# EAGLE design msrgyro (EAGLE 9.6.2)
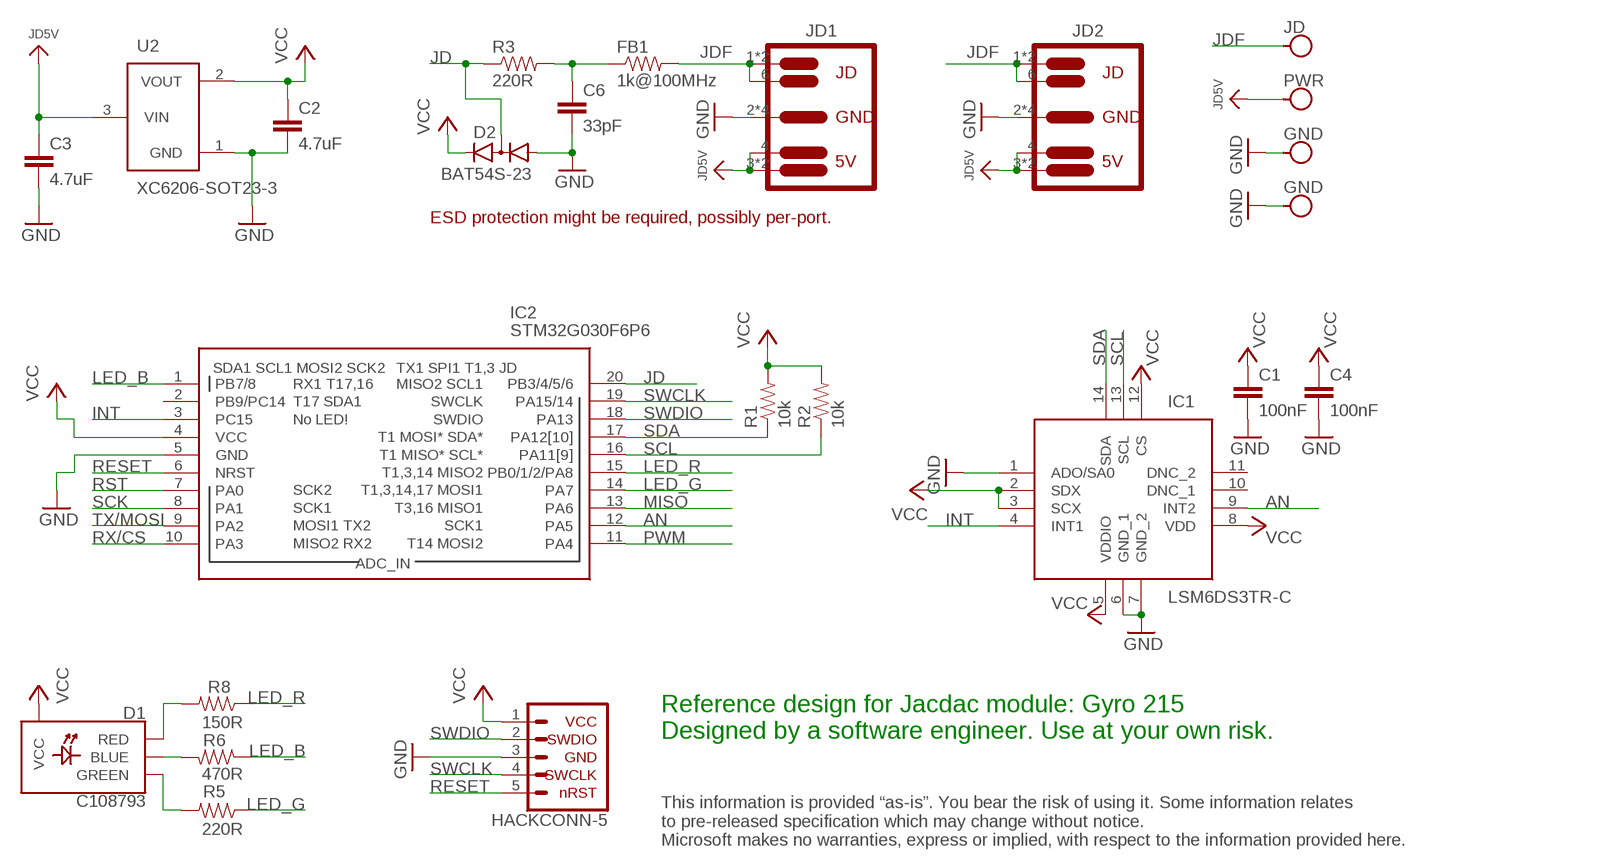
[diagram p0: schematic, sheet 1]

## Parts
C1  100nF  CAP_0402  [0402]
C2  4.7uF  CAP_0402  [0402]
C3  4.7uF  CAP_0402  [0402]
C4  100nF  CAP_0402  [0402]
C6  33pF  CAP_0402  [0402]
D1  C108793  LED-RGB-CA-2020  [LED-RGB-2020]
D2  BAT54S-23  [SOT23-3]
FB1  1k@100MHz  RES_0402  [0402]
IC1  LSM6DS3TR-C  [LGA-14-2.5_3]
IC2  STM32G030F6P6  STM32G030F8P6  [SOP65P640X120-20N]
J1  JD  JACDAC-M3-DATA  [M3-HOLE-DATA]
J2  PWR  JACDAC-M3-PWR  [M3-HOLE-PWR]
J3  GND  JACDAC-M3-GND  [M3-HOLE-GND]
J4  GND  JACDAC-M3-GND  [M3-HOLE-GND]
J6  HACK-CONNECT-5  [HC5-22-62]
JD1  JACDAC-EDGE-OUTIE  [JD-EDGE-OUTIE]
JD2  JACDAC-EDGE-OUTIE  [JD-EDGE-OUTIE]
R1  10k  RES_0402  [0402]
R2  10k  RES_0402  [0402]
R3  220R  RES_0402  [0402]
R5  220R  RES_0402  [0402]
R6  470R  RES_0402  [0402]
R8  150R  RES_0402  [0402]
U2  XC6206-SOT23-3  [SOT23-3-W]

## Nets
AN: IC1.9(INT2) IC2.12(PA5)
GND [gnd]: C1.2 C2.2 C3.2 C4.2 C6.2 D2.1(A1) IC1.1(ADO/SA0) IC1.6(GND_1) IC1.7(GND_2) IC2.5(GND) J3.H J4.H J6.3(GND) JD1.2 JD1.5 JD1.P$2 JD1.P$4 JD2.2 JD2.5 JD2.P$2 JD2.P$4 U2.1(GND)
INT: IC1.4(INT1) IC2.3(PC15)
JD: D2.3(C1A2) IC2.20(PB3/4/5/6) R3.1
JD5V [usbvcc]: C3.1 J2.H JD1.3 JD1.4 JD1.P$1 JD2.3 JD2.4 JD2.P$1 U2.3(VIN)
JDF: FB1.2 J1.H JD1.1 JD1.6 JD1.P$3 JD2.1 JD2.6 JD2.P$3
LED_B: IC2.1(PB7/8) R6.1
LED_G: IC2.14(PA7) R5.1
LED_R: IC2.15(PB0/1/2/PA8) R8.1
MISO: IC2.13(PA6)
N$1: C6.1 FB1.1 R3.2
N$2: D1.B-(BLUE) R6.2
N$3: D1.R-(RED) R8.2
N$4: D1.G-(GREEN) R5.2
PWM: IC2.11(PA4)
RESET: IC2.6(NRST) J6.5(NRST)
RST: IC2.7(PA0)
RX/CS: IC2.10(PA3)
SCK: IC2.8(PA1)
SCL: IC1.13(SCL) IC2.16(PA11[9]) R2.1
SDA: IC1.14(SDA) IC2.17(PA12[10]) R1.1
SWCLK: IC2.19(PA15/14) J6.4(SWCLK)
SWDIO: IC2.18(PA13) J6.2(SWDIO)
TX/MOSI: IC2.9(PA2)
VCC: C1.1 C2.1 C4.1 D1.PLUS(VCC) D2.2(C2) IC1.2(SDX) IC1.3(SCX) IC1.5(VDDIO) IC1.8(VDD) IC1.12(CS) IC2.4(VCC) J6.1(VCC) R1.2 R2.2 U2.2(VOUT)
Unconnected: IC1.10(DNC_1) IC1.11(DNC_2) IC2.2(PB9/PC14)

## Notes on the sheet
- ESD protection might be required, possibly per-port.
- Reference design for Jacdac module: Gyro 215
  Designed by a software engineer. Use at your own risk.
- This information is provided “as-is”. You bear the risk of using it. Some information relates
  to pre-released specification which may change without notice.
  Microsoft makes no warranties, express or implied, with respect to the information provided here.

## Library data of the parts
C1-C4 C6 = jacdac:CAP_0402: 0402 (1005 Metric) Nick Garner - TeleSense
D1 = jacdac:LED-RGB-CA: RGB LED, common anode
D2 = jacdac:BAT54S: B54S two Schottky Diodes JLC408389 ALT: JLC 47546
FB1 R1-R3 R5 R6 R8 = jacdac:RES_0402: 0402 (1005 Metric) Nick Garner - TeleSense
IC1 = jacdac:LSM6DS3TR-C: LSM6DS3TR-C gyroscope and accelerometer JLC967633 Datasheet <http://www.st.com/resource/en/datasheet/lsm6ds3tr-c.pdf>
IC2 = jacdac:STM32G030F8P6: STM32G030F6P6 TSSOP-20 JLC724040
J1-J4 = jacdac:JACDAC-M3: Jacdac mounting Hole M3
J6 = jacdac:HACK-CONNECT-5
JD1 JD2 = jacdac:JACDAC-EDGE
U2 = jacdac:XC6206: JLC5446

## Net classes
0 default: width 0.152 mm
1 power: width 0.152 mm
2 gnd: width 0.152 mm
3 usbvcc: width 0.305 mm

## Board
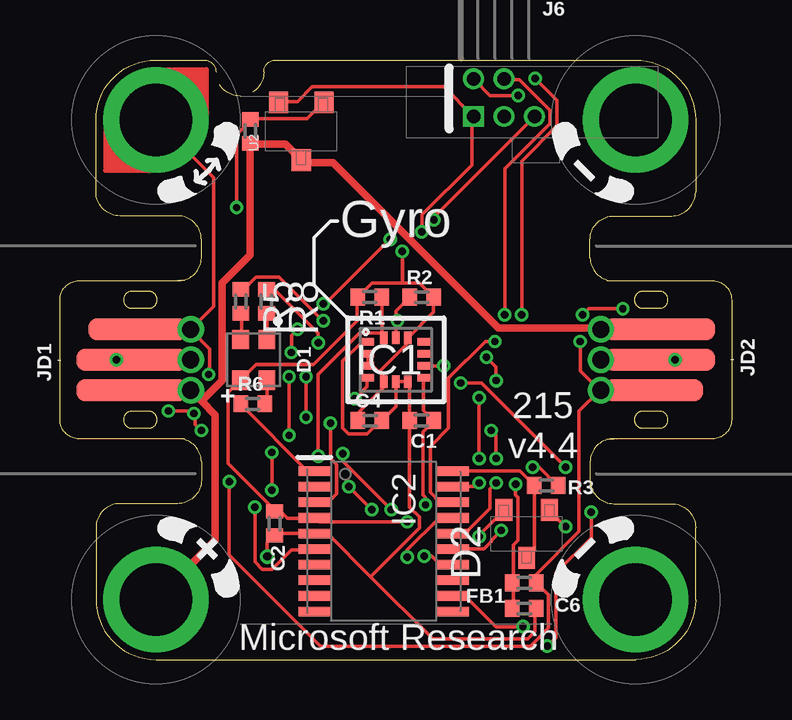
[diagram p1: board, top side]
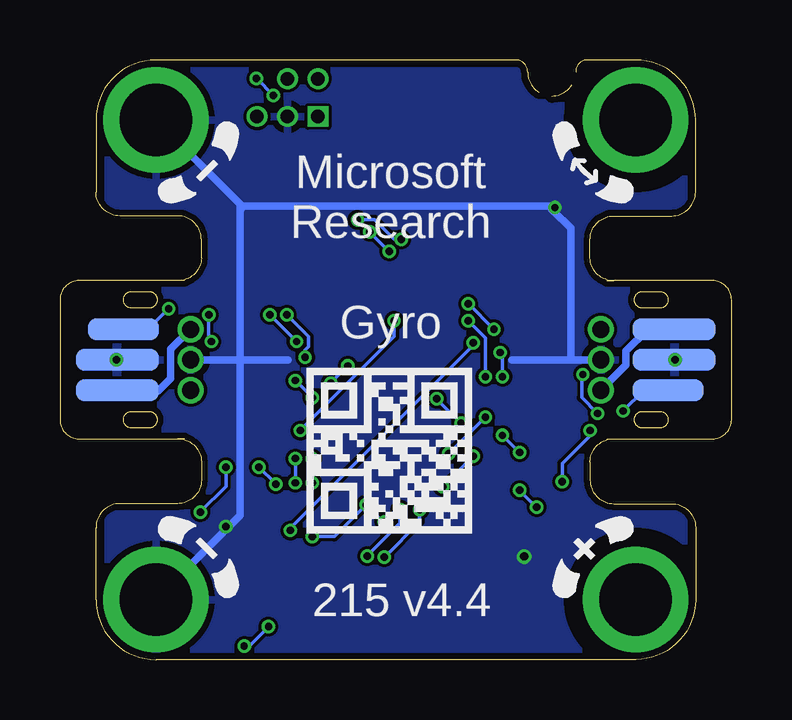
[diagram p2: board, bottom side, seen from below]

Size 28 x 25 mm. Coordinates in mm from the lower left corner, seen from the top.
Outline: 26.5,5.5 26.5,2.5 arc-90 24,0 4,0 arc-90 1.5,2.5 1.5,5.5
Outline: 1.5,19.5 1.5,22.5 arc-90 4,25 6,25 arc-90 6.5,24.5 arc90 7.5,23.5 arc90 8.5,24.5 arc-90 9,25 24,25 arc-90 26.5,22.5 26.5,19.5
Copper layers (1*16): Top 0.035559375mm / dielectric 1.6mm / Bottom 0.035559375mm
Design rules "jlcpcb": minimum track width 5mil, minimum drill 12mil, track to track 5mil, track to pad 5mil, pad to pad 5mil, via to via 5mil, smd to smd 5mil, copper to edge 10mil, drill to drill 8mil, minimum pad ring 5mil, minimum via ring 5mil, stop-mask expansion 2.5mil, vias tented up to drill 30mil, thermal gap 10mil

### Footprints (pad centres in the part's own frame; a part is rotated, then mirrored left to right if it is on the bottom)
0402 = smd 0.6 x 0.7: 1 -0.5,0; 2 0.5,0
LED-RGB-2020 = smd 0.8 x 0.7: B- 0.85,0.55; G- -0.85,-0.55; PLUS 0.85,-0.55; R- -0.85,0.55
SOT23-3 = smd 0.9 x 0.7: 1 1,-0.95; 2 1,0.95; 3 -1,0
LGA-14-2.5_3 = smd 0.52 x 0.32: 1 -1.16,0.75; 2 -1.16,0.25; 3 -1.16,-0.25; 4 -1.16,-0.75; 8 1.16,-0.75; 9 1.16,-0.25; 10 1.16,0.25; 11 1.16,0.75 | smd 0.32 x 0.52: 5 -0.5,-0.912; 6 0,-0.912; 7 0.5,-0.912; 12 0.5,0.912; 13 0,0.912; 14 -0.5,0.912
SOP65P640X120-20N = smd 0.4 x 1.35: 1 -2.925,-2.875; 2 -2.275,-2.875; 3 -1.625,-2.875; 4 -0.975,-2.875; 5 -0.325,-2.875; 6 0.325,-2.875; 7 0.975,-2.875; 8 1.625,-2.875; 9 2.275,-2.875; 10 2.925,-2.875; 11 2.925,2.875; 12 2.275,2.875; 13 1.625,2.875; 14 0.975,2.875; 15 0.325,2.875; 16 -0.325,2.875; 17 -0.975,2.875; 18 -1.625,2.875; 19 -2.275,2.875; 20 -2.925,2.875
M3-HOLE-DATA = drill 3.03 pad 4.4: H 0,0
M3-HOLE-PWR = drill 3.03 pad 4.4: H 0,0
M3-HOLE-GND = drill 3.03 pad 4.4: H 0,0
HC5-22-62 = drill 0.559 pad 0.864 square: 1 0,0 | drill 0.559 pad 0.864: 2 0,1.575; 3 1.27,0; 4 1.27,1.575; 5 2.54,0
JD-EDGE-OUTIE = smd 0.9 x 4.1: 1 1.27,-3.25 | smd 0.9 x 4.6: 2 0,-3; 3 -1.27,-3 | smd 0.9 x 3.45 bottom: 4 1.27,-2.4; 5 0,-2.4 | smd 0.9 x 2.95 bottom: 6 -1.27,-2.65 | drill 0.71 pad 1.1: P$1 -1.27,-5.45; P$2 0,-5.45; P$3 1.27,-5.45 | drill 0.305 pad 0.559: P$4 0,-2.35
SOT23-3-W = smd 0.9 x 0.8: 1 1.2,-0.95; 2 1.2,0.95; 3 -1.2,0

### Placement (x,y rotation side)
C1  15.08,9.97 180 top
C2  8.95,5.68 270 top
C3  7.93,22.03 90 top
C4  12.92,9.97 0 top
C6  19.35,2.13 0 top
D1  8.08,12.5 270 top
D2  19.46,5.24 90 top
FB1  19.35,3.2 0 top
IC1  14,12.5 0 top
IC2  13.49,4.93 270 top
J1  4,22.5 0 top
J2  4,2.5 0 top
J3  24,2.5 0 top
J4  24,22.5 90 top
J6  17.24,22.64 0 top
JD1  0,12.5 90 top
JD2  28,12.5 270 top
R1  12.92,15.11 180 top
R2  15.08,15.11 0 top
R3  20.27,7.26 0 top
R5  7.54,14.94 270 top
R6  8.03,10.66 0 top
R8  8.61,14.94 270 top
U2  10.06,22.02 90 top

### Tracks (layer width: path | path; a pad name or v marks a point on that pad's centre or on a via)
AN  (via drill 0.3)
  Top 0.152: v16,12.24 15.19,12.24 IC1.9 | v16.71,11.53 17.58,11.53 v21.08,8.03 | v22.15,6.15 22.15,5.08 20.68,3.61 20.68,0.91 v20.32,0.56 | v19.3,1.37 18.19,1.37 16.92,2.64 16.41,2.64 IC2.12
  Bottom 0.152: v16.71,11.53 v16,12.24 | v21.08,8.03 21.08,7.21 v22.15,6.15 | v20.32,0.56 20.12,0.56 v19.3,1.37
GND  (via drill 0.3, 0.35)
  Top 0.152: v8.64,4.3 8.64,4.87 C2.2 9.03,5.26 10.56,5.26 10.57,5.23 IC2.5 10.67,5.23 11.18,5.23 12.95,3.45 | JD1.P$2 JD1.2 JD1.P$4 | JD2.P$2 JD2.2 JD2.P$4 | U2.1 10.97,23.22 10.31,22.55 7.98,22.55 C3.2 7.92,22.45 7.37,21.89 v7.37,18.85 | IC1.1 12.8,13.21 12.55,13.21 11.79,12.45 11.79,9.65 12.04,9.4 12.8,9.4 13.36,9.96 C4.2 14,10.54 IC1.6 IC1.7 14.58,11.51 C1.2 14.58,9.91 14.58,6.35 14.99,5.94 14.99,5.49 12.95,3.45 | v21.08,5.54 20.42,6.2 D2.1 | 12.95,3.45 15.54,0.86 19.51,0.86 19.81,1.17 19.81,2.13 C6.2
  Bottom 0.152: v21.08,5.54 21.02,5.48 | v7.37,18.85 7.47,18.75
  Bottom 0.305: JD1.P$2 6.71,12.5 | 6.71,12.5 9.14,12.5 9.16,12.49 | JD2.P$2 18.51,12.5 18.5,12.49 | J3.H 21.02,5.48 20.5,6 20.5,18.75 | J4.H 20.5,19 20.5,18.75 | 6.71,12.5 6.71,17.98 7.47,18.75 7.62,18.9 20.34,18.9 20.5,18.75
  pour Bottom: 2,25 2,0 26,0 26,25
INT  (via drill 0.3)
  Top 0.152: v12.29,10.87 12.8,11.38 12.8,11.73 IC1.4 | v11.28,9.86 11.28,8.38 11.53,8.13 11.53,6.91 11.23,6.6 10.67,6.6 IC2.3
  Bottom 0.152: v11.28,9.86 v12.29,10.87
JD
  Top 0.152: IC2.20 19.18,7.86 R3.1 19.77,4.56 D2.3
JD5V
  Top 0.305: J2.H 6.31,4.81 6.48,4.98 6.48,10.2 5.9,10.78 | 5.9,10.78 JD1.P$1 5.33,11.23 3.05,11.23 JD1.3 | JD2.3 JD2.P$1 22.4,13.82 18.29,13.82 11.38,20.73 10.16,20.73 U2.3 9.4,21.49 7.98,21.49 C3.1 7.92,21.34 7.92,16.87 6.76,15.7 6.76,11.63 5.9,10.78
  Bottom 0.305: JD1.P$1 4.4,12.28 4.4,12.86 3.49,13.77 JD1.4 | JD2.P$1 23.38,12.94 23.38,11.72 23.91,11.19 25.56,11.19 JD2.4
JDF  (via drill 0.3)
  Top 0.152: J1.H 6.4,20.1 6.4,17.42 6.4,14.72 JD1.P$3 5.49,13.72 6.25,12.95 6.25,12.19 6.2,12.14 v6.2,11.89 | v4.52,10.36 5.49,10.36 v5.59,10.26 5.64,10.21 5.64,9.8 v5.89,9.55 | v23.47,14.63 22.05,14.63 v21.79,14.38 | v21.69,13.26 21.69,12.04 22.45,11.28 JD2.P$3 22.5,11.23 21.64,10.36 21.64,5.33 19.86,3.56 19.86,3.2 FB1.2 19.91,3.15 20.37,2.69 20.37,1.32 19.61,0.56 10.87,0.56 7.06,4.37 v7.06,7.42
  Bottom 0.152: v4.52,10.36 3.66,11.23 2.69,11.23 JD1.6 | v5.59,10.26 6.25,10.92 6.25,11.84 v6.2,11.89 | v23.47,14.63 24.28,13.82 25.35,13.82 JD2.6 | v21.79,14.38 21.79,13.36 v21.69,13.26 | v5.89,9.55 5.89,9.35 7.06,8.18 v7.06,7.42
LED_B
  Top 0.152: R6.1 7.57,10.62 10.31,7.87 10.62,7.87 IC2.1
LED_G  (via drill 0.3)
  Top 0.152: v10.97,14.12 9.14,15.95 8.18,15.95 7.67,15.44 7.57,15.44 R5.1 | v10.26,10.11 v10.26,11.79 | v11.79,8.59 11.79,8.28 v13.82,6.25 | v15.19,4.32 15.49,4.32 15.85,3.96 16.36,3.96 IC2.14
  Bottom 0.152: v10.97,14.12 10.26,13.41 v10.26,11.79 | v11.79,8.59 v10.26,10.11 | v13.82,6.25 13.82,5.69 v15.19,4.32
LED_R  (via drill 0.3)
  Top 0.152: v10.77,13.21 10.77,13.61 8.99,15.39 8.64,15.39 R8.1 | v18.39,5.38 17.98,4.98 17.98,4.93 17.68,4.62 16.41,4.62 IC2.15
  Bottom 0.152: v10.77,13.21 10.77,13.11 18.39,5.49 v18.39,5.38
N$1  (via drill 0.3)
  Top 0.152: C6.1 18.9,2.13 18.9,3.2 FB1.1 18.9,3.25 18.9,4.78 19.1,4.98 19.1,6.76 19,6.86 v19,7.32 | v19.71,8.03 19.96,8.03 20.73,7.26 R3.2
  Bottom 0.152: v19,7.32 v19.71,8.03
N$2
  Top 0.152: R6.2 8.64,10.82 8.64,11.63 D1.B-
N$3
  Top 0.152: R8.2 8.64,14.43 D1.R-
N$4
  Top 0.152: R5.2 7.57,14.43 7.57,13.36 D1.G-
RESET  (via drill 0.3)
  Top 0.152: v8.13,6.35 8.13,4.06 8.43,3.76 8.84,3.76 9.65,4.57 10.62,4.57 IC2.6 | v8.84,8.64 v8.84,7.06 | v9.55,11.79 v9.55,9.35 | v9.65,12.8 9.65,13.51 v9.91,13.77 | v10.97,14.83 11.07,14.83 v13.77,17.53 | v15.6,18.34 15.6,18.44 19.76,22.61 J6.5
  Bottom 0.152: v8.84,7.06 v8.13,6.35 | v9.55,9.35 v8.84,8.64 | v9.55,11.79 9.55,12.7 v9.65,12.8 | v10.97,14.83 v9.91,13.77 | v13.77,17.53 14.07,17.53 14.88,18.34 v15.6,18.34
SCL  (via drill 0.3)
  Top 0.152: IC1.13 14,14.12 | 14,14.12 14,14.53 R2.1 | v18.19,7.37 17.93,7.11 17.93,6.3 16.92,5.28 16.41,5.28 IC2.16 | v18.19,8.38 18.19,9.35 v17.98,9.55 | v14.07,14.12 14,14.12
  Bottom 0.152: v18.19,8.38 v18.19,7.37 | v17.98,9.55 14.07,13.46 v14.07,14.12
SDA  (via drill 0.3)
  Top 0.152: R1.1 13.42,13.49 IC1.14 13.36,13.61 12.5,13.61 10.77,11.89 v10.77,8.48 | v13.01,6.25 v12.04,7.21 | v14.48,4.27 14.48,4.57 15.8,5.89 16.36,5.89 IC2.17
  Bottom 0.152: v12.04,7.21 v10.77,8.48 | v13.01,6.25 13.01,5.74 v14.48,4.27
SWCLK  (via drill 0.3)
  Top 0.152: v17.48,7.37 17.32,7.21 16.41,7.21 IC2.19 | v17.48,10.92 v17.48,8.38 | v18.19,11.63 18.19,12.19 v17.78,12.6 | v18.54,14.38 18.54,20.47 20.42,22.35 20.42,22.91 19.15,24.18 18.54,24.18 J6.4
  Bottom 0.152: v17.48,8.38 v17.48,7.37 | v18.19,11.63 v17.48,10.92 | v17.78,12.6 17.78,12.9 17.63,13.06 17.63,13.46 v18.54,14.38
SWDIO  (via drill 0.3)
  Top 0.152: v18.14,13.26 17.73,13.26 16.2,11.73 16.2,9.65 15.44,8.89 15.44,6.96 15.8,6.6 16.36,6.6 IC2.18 | v19.25,14.38 19.25,20.78 20.73,22.25 20.73,23.32 v19.81,24.23 | v19.1,23.52 17.93,23.52 17.27,24.18 J6.2
  Bottom 0.152: v19.25,14.38 v18.14,13.26 | v19.1,23.52 v19.81,24.23
VCC  (via drill 0.3)
  Top 0.152: C4.1 12.42,10.29 13.5,11.37 IC1.5 13.46,11.63 13.46,11.84 13.31,11.99 | IC1.8 15.16,10.38 C1.1 15.54,9.91 15.14,9.5 15.14,6.86 15.24,6.76 v15.24,6.45 | U2.2 9.14,23.27 9.91,23.27 10.52,23.88 16,23.88 17.22,22.66 J6.1 17.17,22.61 17.17,20.62 15.09,18.54 v15.09,17.83 | v17.48,5.13 17.48,5.18 18.49,6.2 D2.2 | IC1.2 12.85,12.7 12.85,12.29 IC1.3 12.9,12.24 13.06,12.24 13.31,11.99 | 14.28,15.7 14.99,15.7 15.54,15.14 R2.2 15.58,14.49 IC1.12 14.48,13.36 14.48,13.16 13.31,11.99 | 14.28,15.7 13.01,15.7 12.45,15.14 R1.2 12.39,15.04 12.39,14.12 10.57,12.29 8.18,12.29 7.57,11.68 D1.PLUS 7.52,11.63 7.01,11.12 7.01,8.18 8.94,6.25 C2.1 9.2,6.18 9.49,5.88 10.53,5.88 10.57,5.94 10.62,5.94 IC2.4 10.67,5.89 10.82,5.74 v14.48,5.74 | 14.28,15.7 v14.28,17.02
  Bottom 0.152: v17.48,5.13 16.56,5.13 v15.24,6.45 14.53,5.74 v14.48,5.74 | v14.28,17.02 v15.09,17.83

### Text on the board
tPlace: Gyro | 215 / v4.4 | Microsoft Research
bPlace: Microsoft / Research / / Gyro | 215 v4.4